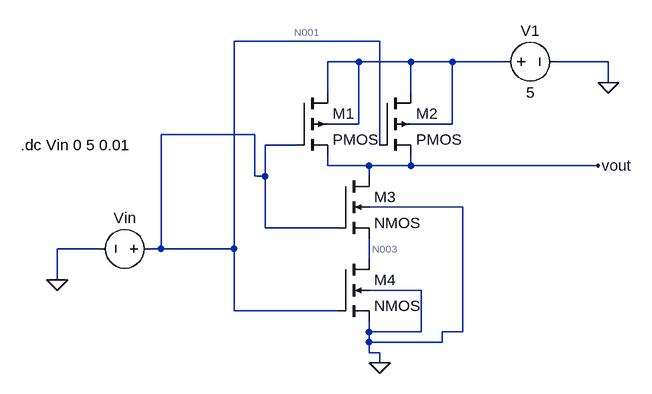
[diagram p0: schematic nand.asc]
nand.asc, the LTspice schematic file:
Version 4.1
SHEET 1 880 680
WIRE 144 -16 -80 -16
WIRE 112 16 64 16
WIRE 192 16 112 16
WIRE 256 16 192 16
WIRE 336 16 256 16
WIRE 496 16 416 16
WIRE 496 48 496 16
WIRE 64 64 64 16
WIRE 192 64 192 16
WIRE 112 112 112 16
WIRE 112 112 64 112
WIRE 256 112 256 16
WIRE 256 112 192 112
WIRE -48 128 -192 128
WIRE 16 144 -32 144
WIRE 144 144 144 -16
WIRE 64 176 64 160
WIRE 128 176 64 176
WIRE 192 176 192 160
WIRE 192 176 128 176
WIRE 480 176 192 176
WIRE -48 192 -48 128
WIRE -32 192 -32 144
WIRE -32 192 -48 192
WIRE 128 192 128 176
WIRE 272 240 128 240
WIRE -32 272 -32 192
WIRE 80 272 -32 272
WIRE -288 304 -352 304
WIRE -192 304 -192 128
WIRE -192 304 -208 304
WIRE -80 304 -80 -16
WIRE -80 304 -192 304
WIRE 128 320 128 288
WIRE -352 352 -352 304
WIRE 208 368 128 368
WIRE -80 400 -80 304
WIRE 80 400 -80 400
WIRE 128 432 128 416
WIRE 208 432 208 368
WIRE 208 432 128 432
WIRE 272 432 272 240
WIRE 272 432 240 432
WIRE 128 448 128 432
WIRE 240 448 240 432
WIRE 240 448 128 448
WIRE 128 464 128 448
WIRE 144 464 128 464
WIRE 144 480 144 464
FLAG 496 48 0
FLAG 144 480 0
FLAG 480 176 vout
FLAG -352 352 0
SYMBOL pmos4 16 64 R0
SYMATTR InstName M1
SYMBOL pmos4 144 64 R0
SYMATTR InstName M2
SYMBOL nmos4 80 192 R0
SYMATTR InstName M3
SYMBOL nmos4 80 320 R0
SYMATTR InstName M4
SYMBOL voltage 320 16 R270
WINDOW 0 32 56 VTop 2
WINDOW 3 -32 56 VBottom 2
WINDOW 123 0 0 Left 0
WINDOW 39 0 0 Left 0
SYMATTR InstName V1
SYMATTR Value 5
SYMBOL voltage -192 304 R90
WINDOW 0 -32 56 VBottom 2
WINDOW 3 -4 56 VBottom 2
WINDOW 123 0 0 Left 0
WINDOW 39 0 0 Left 0
SYMATTR InstName Vin
SYMATTR Value ""
TEXT -408 144 Left 2 !.dc Vin 0 5 0.01

The netlist it stands for:
* nand.asc
M1 N002 N001 vout N002 PMOS
M2 N002 N001 vout N002 PMOS
M3 vout N001 N003 0 NMOS
M4 N003 N001 0 0 NMOS
V1 N002 0 5
Vin N001 0
.model NMOS NMOS
.model PMOS PMOS
.lib standard.mos
.dc Vin 0 5 0.01
.backanno
.end

* Results of the author's LTspice run, read from the files saved beside the schematic
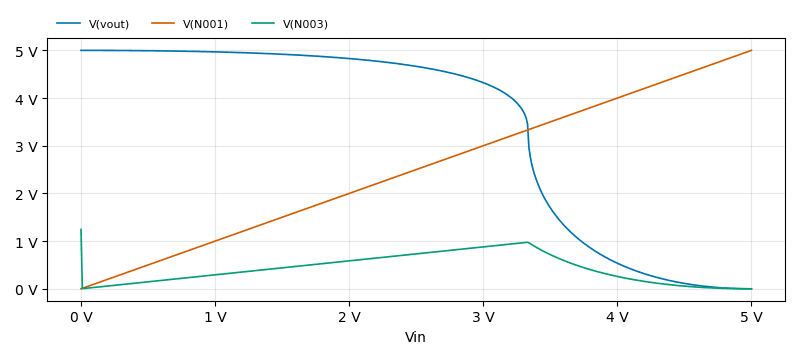
[diagram p1: DC transfer characteristic of nand.asc, plotted from the saved traces]
* DC transfer characteristic, 1 run:
*   V(vout): 5 V at Vin=0 V, 399.8 nV at Vin=5 V, min 399.8 nV, max 5 V
*   V(N001): 0 V at Vin=0 V, 5 V at Vin=5 V, min 0 V, max 5 V
*   V(N003): 1.245 V at Vin=0 V, 200 nV at Vin=5 V, min 200 nV, max 1.245 V